# EAGLE schematic bottom (EAGLE 7.2.0)
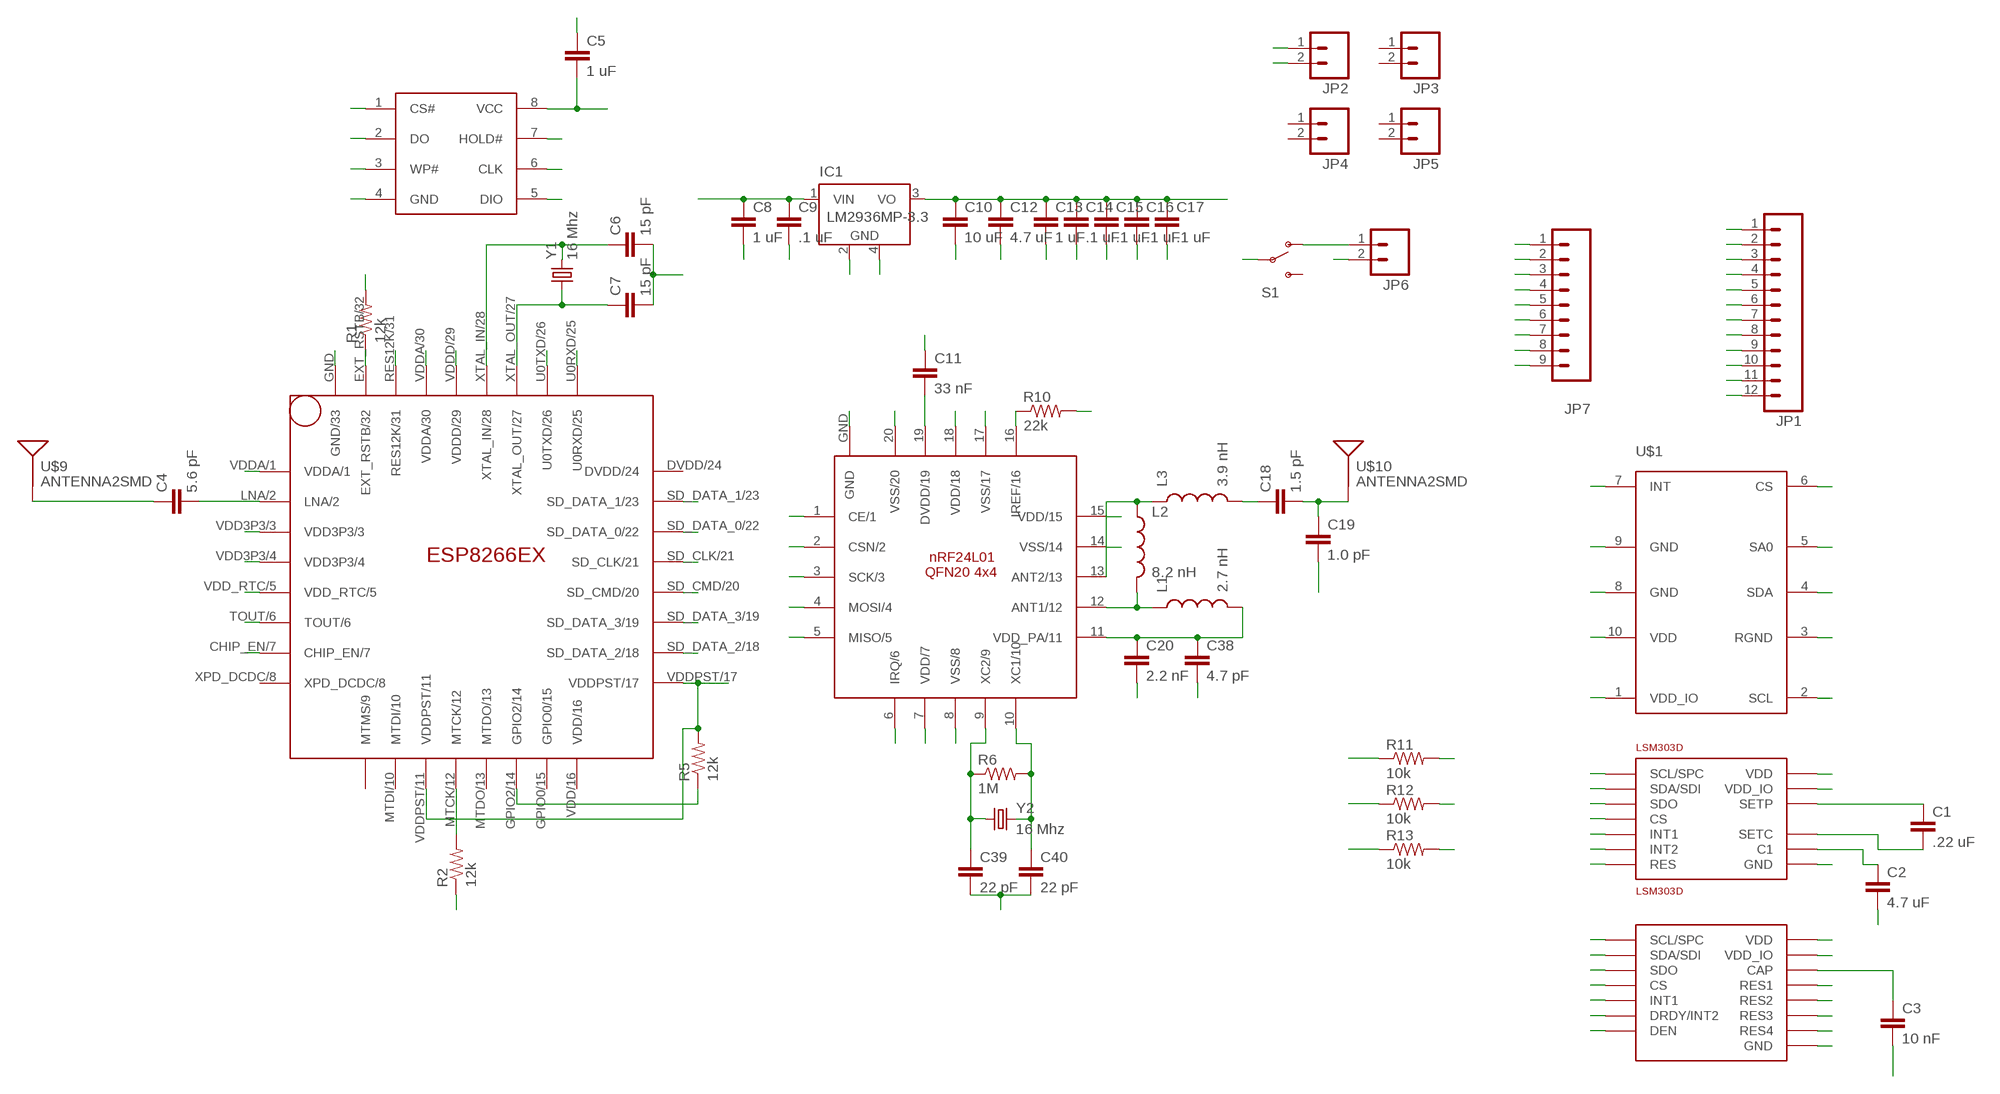
[diagram p0: schematic, sheet 1]

## Parts
C1  .22 uF  CAP0603-CAP  [0603-CAP]
C2  4.7 uF  CAP0603-CAP  [0603-CAP]
C3  10 nF  CAP0603-CAP  [0603-CAP]
C4  5.6 pF  CAP0603-CAP  [0603-CAP]
C5  1 uF  CAP0603-CAP  [0603-CAP]
C6  15 pF  CAP0603-CAP  [0603-CAP]
C7  15 pF  CAP0603-CAP  [0603-CAP]
C8  1 uF  CAP0603-CAP  [0603-CAP]
C9  .1 uF  CAP0603-CAP  [0603-CAP]
C10  10 uF  CAP0603-CAP  [0603-CAP]
C11  33 nF  CAP0603-CAP  [0603-CAP]
C12  4.7 uF  CAP0603-CAP  [0603-CAP]
C13  1 uF  CAP0603-CAP  [0603-CAP]
C14  .1 uF  CAP0603-CAP  [0603-CAP]
C15  .1 uF  CAP0603-CAP  [0603-CAP]
C16  .1 uF  CAP0603-CAP  [0603-CAP]
C17  .1 uF  CAP0603-CAP  [0603-CAP]
C18  1.5 pF  CAP0603-CAP  [0603-CAP]
C19  1.0 pF  CAP0603-CAP  [0603-CAP]
C20  2.2 nF  CAP0603-CAP  [0603-CAP]
C38  4.7 pF  CAP0603-CAP  [0603-CAP]
C39  22 pF  CAP0603-CAP  [0603-CAP]
C40  22 pF  CAP0603-CAP  [0603-CAP]
IC1  LM2936MP-3.3  [SOT223]
JP1  M12PTH  [1X12]
JP2  M02LOCK  [1X02_LOCK]
JP3  M02LOCK  [1X02_LOCK]
JP4  M02LOCK  [1X02_LOCK]
JP5  M02LOCK  [1X02_LOCK]
JP6  M02LOCK  [1X02_LOCK]
JP7  M09  [1X09]
L1  2.7 nH  INDUCTOR0402  [C0402]
L2  8.2 nH  INDUCTOR0402  [C0402]
L3  3.9 nH  INDUCTOR0402  [C0402]
L3GD20H  L3GD20H  [LGA16L]
LSM303D  LSM303D  [LGA16L]
MESH  NRF24L01  [QFN20(4X4)]
R1  12k  RESISTOR0603-RES  [0603-RES]
R2  12k  RESISTOR0603-RES  [0603-RES]
R5  12k  RESISTOR0603-RES  [0603-RES]
R6  1M  RESISTOR0603-RES  [0603-RES]
R10  22k  RESISTOR0603-RES  [0603-RES]
R11  10k  RESISTOR0603-RES  [0603-RES]
R12  10k  RESISTOR0603-RES  [0603-RES]
R13  10k  RESISTOR0603-RES  [0603-RES]
S1  SWITCH-SPDT-SMD-A  [SWITCH-SPST-SMD-A]
U$1  LPS25H  [LPS25H]
U$9  ANTENNA2SMD  [ANTENNA-CHIP2]
U$10  ANTENNA2SMD  [ANTENNA-CHIP2]
WIFI  ESP8266EX  [QFN32]
WIFI_STORAGE  25Q40  [SOP8]
Y1  16 Mhz  CRYSTAL5X3  [CRYSTAL-SMD-5X3]
Y2  16 Mhz  CRYSTAL5X3  [CRYSTAL-SMD-5X3]

## Nets
CE: JP7.3 MESH.1(CE/1)
CSN: JP7.4 MESH.2(CSN/2)
GND: C2.2 C3.2 C5.1 C6.2 C7.2 C8.2 C9.2 C10.2 C11.1 C12.2 C13.2 C14.2 C15.2 C16.2 C17.2 C19.2 C20.2 C38.2 C39.2 C40.2 IC1.2(GND) IC1.4(GND) JP1.1 JP1.2 JP1.3 JP1.4 JP1.5 JP1.6 JP2.2 JP6.2 L3GD20H.P$8(DEN) L3GD20H.P$9(RES1) L3GD20H.P$10(RES2) L3GD20H.P$11(RES3) L3GD20H.P$12(GND) L3GD20H.P$13(GND) LSM303D.P$5(GND) LSM303D.P$10(RES) LSM303D.P$12(GND) LSM303D.P$13(GND) LSM303D.P$16(GND) MESH.8(VSS/8) MESH.14(VSS/14) MESH.17(VSS/17) MESH.20(VSS/20) R1.2 R2.1 R10.2 U$1.3(RGND) U$1.8(GND) U$1.9(GND) WIFI.GND(GND/33) WIFI_STORAGE.4(GND)
IQR: MESH.6(IRQ/6)
MISO: JP7.6 MESH.5(MISO/5)
MOSI: JP7.5 MESH.4(MOSI/4)
N$1: C4.1 U$9.FEED(SIGNAL)
N$2: R5.1 WIFI.GPIO2/14
N$3: R2.2 WIFI.MTCK/12
N$5: L1.1 L2.2 MESH.12(ANT1/12)
N$6: C18.1 L3.2
N$10: C18.2 C19.1 U$10.FEED(SIGNAL)
N$13: C4.2 WIFI.LNA/2
N$14: U$1.7(INT)
N$16: C39.1 MESH.9(XC2/9) R6.1 Y2.1
N$17: C40.1 MESH.10(XC1/10) R6.2 Y2.3
N$18: C20.1 C38.1 L1.2 MESH.11(VDD_PA/11)
N$19: L2.1 L3.1 MESH.13(ANT2/13)
N$24: MESH.16(IREF/16) R10.1
N$28: C11.2 MESH.19(DVDD/19)
N$30: MESH.GND
N$35: LSM303D.P$11(INT1)
N$36: LSM303D.P$9(INT2)
N$38: WIFI.RES12K/31
N$42: C1.2 LSM303D.P$2(SETC)
N$43: C2.1 LSM303D.P$15(C1)
N$49: L3GD20H.P$7(INT1)
N$50: L3GD20H.P$6(DRDY/INT2)
N$54: C3.1 L3GD20H.P$14(CAP)
RST: R1.1 WIFI.EXT_RSTB/32
RTC: WIFI.VDD_RTC/5
RX_W: JP7.1 WIFI.U0TXD/26
SCK: JP7.7 MESH.3(SCK/3)
SCL: JP7.9 L3GD20H.P$2(SCL/SPC) LSM303D.P$4(SCL/SPC) R12.2 U$1.2(SCL)
SD-CLK: WIFI.SD_CLK/21 WIFI_STORAGE.6(CLK)
SD-CMD: WIFI.SD_CMD/20 WIFI_STORAGE.1(CS#)
SD-D0: WIFI.SD_DATA_0/22 WIFI_STORAGE.2(DO)
SD-D1: WIFI.SD_DATA_1/23 WIFI_STORAGE.5(DIO)
SD-D2: WIFI.SD_DATA_2/18 WIFI_STORAGE.7(HOLD#)
SD-D3: WIFI.SD_DATA_3/19 WIFI_STORAGE.3(WP#)
SDA: JP7.8 L3GD20H.P$3(SDA/SDI) LSM303D.P$6(SDA/SDI) R11.2 U$1.4(SDA)
SDO: L3GD20H.P$4(SDO) LSM303D.P$7(SDO) R13.2 U$1.5(SA0)
SETP: C1.1 LSM303D.P$3(SETP)
TOUT: WIFI.TOUT/6
TX_W: JP7.2 WIFI.U0RXD/25
VDD: C5.2 C10.1 C12.1 C13.1 C14.1 C15.1 C16.1 C17.1 IC1.3(VO) JP1.7 JP1.8 JP1.9 JP1.10 JP1.11 JP1.12 JP2.1 L3GD20H.P$1(VDD_IO) L3GD20H.P$5(CS) L3GD20H.P$15(RES4) L3GD20H.P$16(VDD) LSM303D.P$1(VDD_IO) LSM303D.P$8(CS) LSM303D.P$14(VDD) MESH.7(VDD/7) MESH.15(VDD/15) MESH.18(VDD/18) R5.2 R11.1 R12.1 R13.1 U$1.1(VDD_IO) U$1.6(CS) U$1.10(VDD) WIFI.CHIP_EN/7 WIFI.VDD3P3/3 WIFI.VDD3P3/4 WIFI.VDDA/1 WIFI.VDDA/30 WIFI.VDDD/29 WIFI.VDDPST/11 WIFI.VDDPST/17 WIFI_STORAGE.8(VCC)
VIN: JP6.1 S1.1(O)
VRAW: C8.1 C9.1 IC1.1(VIN) S1.2(P)
XTAL_IN: C6.1 WIFI.XTAL_IN/28 Y1.3
XTAL_OUT: C7.1 WIFI.XTAL_OUT/27 Y1.1
Unconnected: JP3.1 JP3.2 JP4.1 JP4.2 JP5.1 JP5.2 S1.3(S) WIFI.DVDD/24 WIFI.GPIO0/15 WIFI.MTDI/10 WIFI.MTDO/13 WIFI.MTMS/9 WIFI.VDD/16 WIFI.XPD_DCDC/8

## Library data of the parts
C1-C20 C38-C40 = SparkFun-Capacitors:CAP: Capacitor Standard 0603 ceramic capacitor, and 0.1" leaded capacitor.
IC1 = national-semiconductor:LM2936MP?*: Ultra-Low Quiescent Current LDO Voltage Regulator Source: Data sheet <http://www.national.com/ds/LM/LM2936.pdf>; MF: NATIONAL SEMICONDUCTOR; MPN: LM2936MP-3.3/NOPB; OC_FARNELL: 1469062; OC_NEWARK: 41K4523
JP1 = SparkFun-Connectors:M12: Header 12 Standard 12-pin 0.1" header. Use with straight break away headers (SKU : PRT-00116), right angle break away headers (PRT-00553), swiss pins (PRT-00743), machine pins (PRT-00117), and female headers (PRT-00115).
JP2-JP6 = SparkFun-Connectors:M02: Standard 2-pin 0.1" header. Use with - straight break away headers ( PRT-00116) - right angle break away headers (PRT-00553) - swiss pins (PRT-00743) - machine pins (PRT-00117) - female headers (PRT-00115) Molex polarized connector foot print use with: PRT-08233 with associated crimp pins and housings. 2.54_SCREWTERM for use with PRT-10571. 3.5mm Screw Terminal footprints for PRT-08084 5mm Screw Terminal footprints for use with PRT-08432
JP7 = SparkFun-Connectors:M09: Header 9 Standard 9-pin 0.1" header. Use with straight break away headers (SKU : PRT-00116), right angle break away headers (PRT-00553), swiss pins (PRT-00743), machine pins (PRT-00117), and female headers (PRT-00115).
L1-L3 = SparkFun-Passives:INDUCTOR: Inductors Basic Inductor/Choke - 0603 and 1206. Footprints are not proven and vary greatly between part numbers. INDUCTOR POWER 3.3UH 4.0A SMD 0.197" L x 0.197" W x 0.177" H (5.00mm x 5.00mm x 4.50mm)
L3GD20H = st:L3GD20H
LSM303D = st:LSM303D
MESH = RF:NRF24L01
R1 R2 R5 R6 R10-R13 = SparkFun-Resistors:RESISTOR: Resistor Basic schematic elements and footprints for 0603, 1206, and PTH resistors.
S1 = SparkFun-Electromechanical:SWITCH-SPDT: SPDT Switch Simple slide switch, Spark Fun Electronics SKU : COM-00102 DPDT SMT slide switch, AYZ0202, SWCH-08179
U$1 = chips:LPS25H: ST-Micro Piezoresistive pressure sensor; DIGIKEY: 497-15070-1-ND
U$9 U$10 = SparkFun-RF:ANTENNA2: Chip antenna Single endded antenna. Common with smaller chip antennas. CHIP4 package is the GPS Chip Antenna SKU: GPS-08418. CHIP5 package is 2.4GHz chip antenna SKU: WRL-00144.
WIFI = wifi:ESP8266EX
WIFI_STORAGE = wifi:25Q40
Y1 Y2 = SparkFun-FreqCtrl:CRYSTAL: Various standard crystals. Proven footprints.; PROD_ID: XTAL-08218